# EAGLE design Pwm (EAGLE 7.4.0)
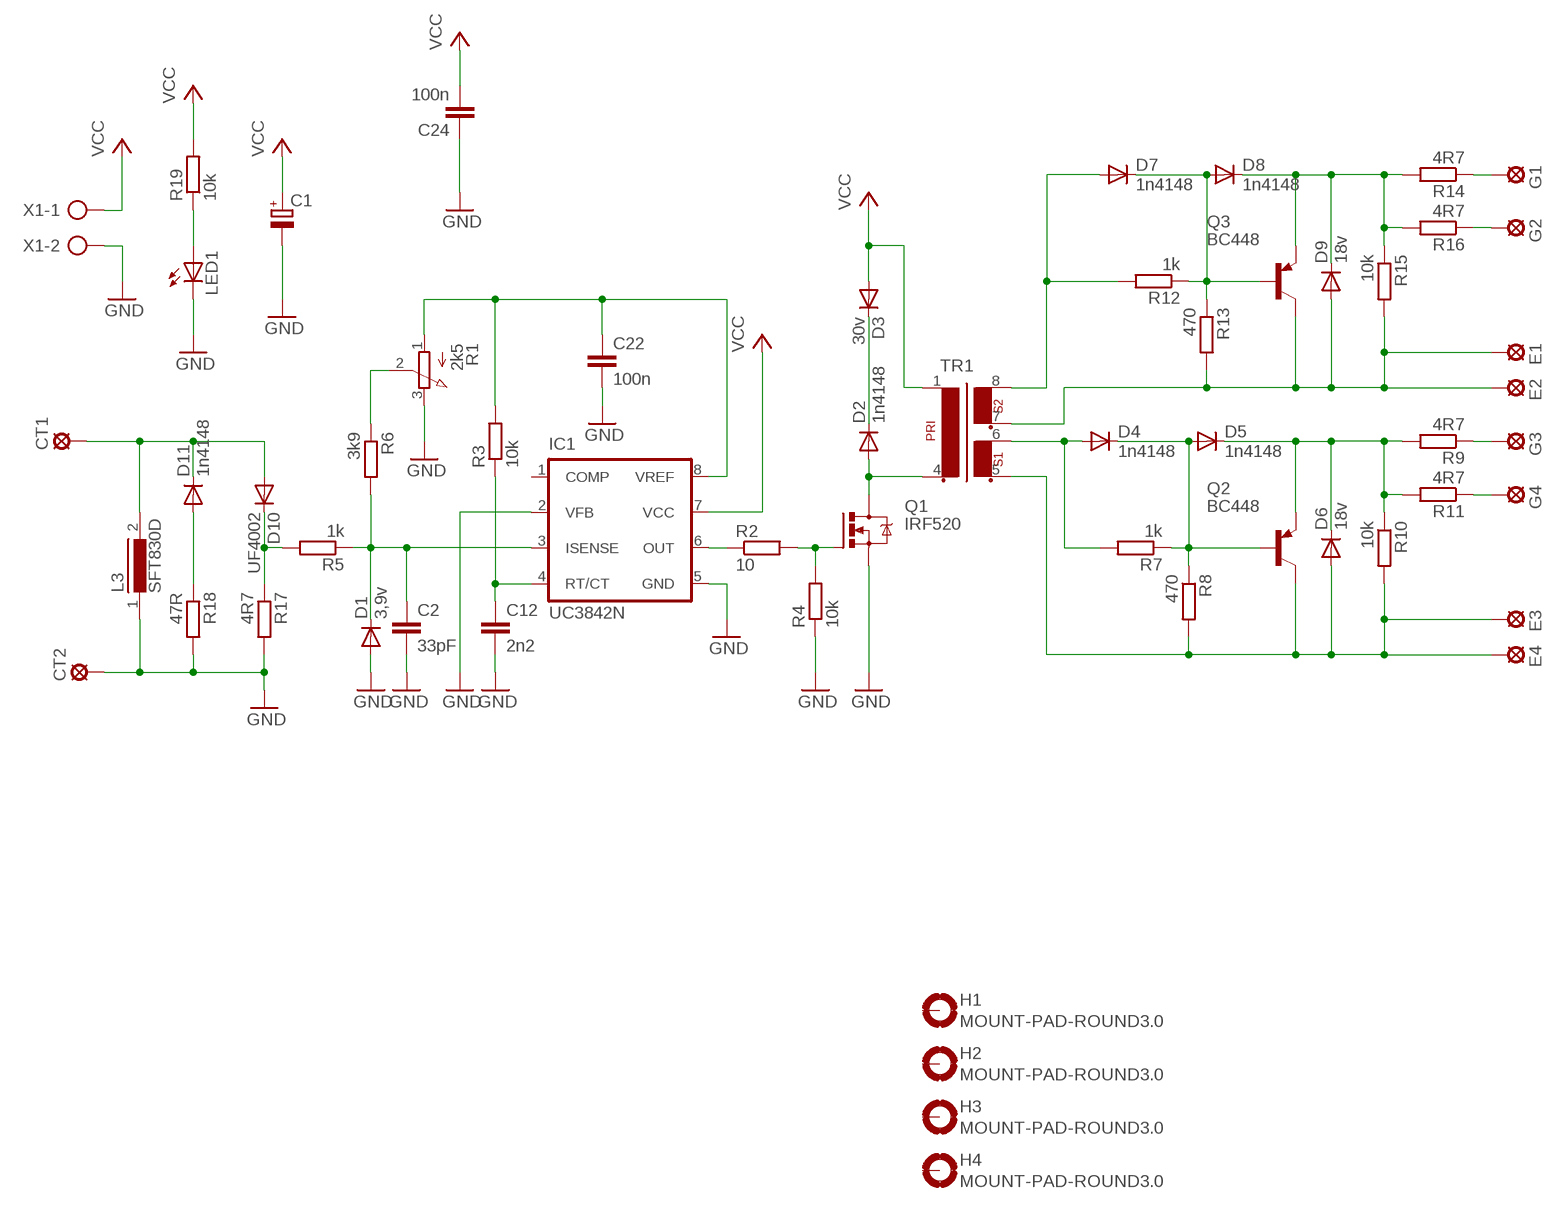
[diagram p0: schematic, sheet 1]

## Parts
C1  CPOL-EUE5-6  [E5-6]
C2  33pF  C-EU050-025X075  [C050-025X075]
C12  2n2  C-EU050-025X075  [C050-025X075]
C22  100n  C-EU050-025X075  [C050-025X075]
C24  100n  C-EU050-025X075  [C050-025X075]
CT1  SE14  [SE14]
CT2  SE14  [SE14]
D1  3,9v  1N4446  [DO35-10]
D2  1n4148  1N4446  [DO35-10]
D3  30v  1N4446  [DO35-10]
D4  1n4148  1N4446  [DO35-10]
D5  1n4148  1N4446  [DO35-10]
D6  18v  1N4446  [DO35-10]
D7  1n4148  1N4446  [DO35-10]
D8  1n4148  1N4446  [DO35-10]
D9  18v  1N4446  [DO35-10]
D10  UF4002  1N4446  [DO35-10]
D11  1n4148  1N4446  [DO35-10]
E1  SE14  [SE14]
E2  SE14  [SE14]
E3  SE14  [SE14]
E4  SE14  [SE14]
G1  SE14  [SE14]
G2  SE14  [SE14]
G3  SE14  [SE14]
G4  SE14  [SE14]
H1  MOUNT-PAD-ROUND3.0  [3,0-PAD]
H2  MOUNT-PAD-ROUND3.0  [3,0-PAD]
H3  MOUNT-PAD-ROUND3.0  [3,0-PAD]
H4  MOUNT-PAD-ROUND3.0  [3,0-PAD]
IC1  UC3842N  [DIL08]
L3  SFT830D  [SFT830D]
LED1  LED5MM  [LED5MM]
Q1  IRF520  [TO220BV]
Q2  BC448  [TO92-EBC]
Q3  BC448  [TO92-EBC]
R1  2k5  3RP/1610N  [3RP/1610N]
R2  10  R-EU_0207/10  [0207/10]
R3  10k  R-EU_0207/10  [0207/10]
R4  10k  R-EU_0207/10  [0207/10]
R5  1k  R-EU_0207/10  [0207/10]
R6  3k9  R-EU_0207/10  [0207/10]
R7  1k  R-EU_0207/10  [0207/10]
R8  470  R-EU_0207/10  [0207/10]
R9  4R7  R-EU_0207/10  [0207/10]
R10  10k  R-EU_0207/10  [0207/10]
R11  4R7  R-EU_0207/10  [0207/10]
R12  1k  R-EU_0207/10  [0207/10]
R13  470  R-EU_0207/10  [0207/10]
R14  4R7  R-EU_0207/10  [0207/10]
R15  10k  R-EU_0207/10  [0207/10]
R16  4R7  R-EU_0207/10  [0207/10]
R17  4R7  R-EU_0207/10  [0207/10]
R18  47R  R-EU_0207/10  [0207/10]
R19  10k  R-EU_0207/10  [0207/10]
TR1  EE20-2  [EE20-2]
X1  AK300/2  [AK300/2]

## Nets
GND: C1.- C2.2 C12.2 C22.2 C24.1 CT2.MP D1.A IC1.2(VFB) IC1.5(GND) L3.1 LED1.K(C) Q1.S R1.3(E) R4.1 R17.2 R18.2 X1.2
GND1: D6.A E3.MP E4.MP Q2.C R8.2 R10.2 TR1.5
GND2: D9.A E1.MP E2.MP Q3.C R13.2 R15.2 TR1.7
N$1: C22.1 IC1.8(VREF) R1.1(A) R3.2
N$2: C12.1 IC1.4(RT/CT) R3.1
N$3: IC1.6(OUT) R2.1
N$4: Q1.G R2.2 R4.2
N$5: C2.1 D1.C IC1.3(ISENSE) R5.1 R6.2
N$6: D2.A Q1.D TR1.4
N$7: R1.2(S) R6.1
N$8: D2.C D3.C
N$9: LED1.A R19.1
N$10: D5.C D6.C Q2.E R9.2 R10.1 R11.2
N$11: D4.C D5.A Q2.B R7.1 R8.1
N$12: D4.A R7.2 TR1.6
N$13: G3.MP R9.1
N$14: G4.MP R11.1
N$16: D8.C D9.C Q3.E R14.2 R15.1 R16.2
N$17: D7.C D8.A Q3.B R12.1 R13.1
N$18: D7.A R12.2 TR1.8
N$19: G1.MP R14.1
N$20: G2.MP R16.1
N$21: D11.A R18.1
N$22: D10.C R5.2 R17.1
N$23: CT1.MP D10.A D11.C L3.2
VCC: C1.+ C24.2 D3.A IC1.7(VCC) R19.2 TR1.1 X1.1
Unconnected: H1.B3,0(MOUNT) H2.B3,0(MOUNT) H3.B3,0(MOUNT) H4.B3,0(MOUNT) IC1.1(COMP)

## Library data of the parts
C1 = rcl:CPOL-EU: POLARIZED CAPACITOR, European symbol
C2 C12 C22 C24 = rcl:C-EU: CAPACITOR, European symbol
CT1 CT2 E1-E4 G1-G4 = solpad:SE14: SOLDER PAD E1553, drill 1,4mm, distributor Buerklin, 07F820
D1-D11 = diode:1N4446: DIODE high speed (Philips)
H1-H4 = holes:MOUNT-PAD-ROUND: MOUNTING PAD, round
IC1 = v-reg:UC384*: SMPS Controller Source: http://www.fairchildsemi.com/ds/UC/UC3843.pdf
L3 = inductors:SFT830D: INDUCTOR
LED1 = led:LED: LED OSRAM: - CHIPLED LG R971, LG N971, LY N971, LG Q971, LY Q971, LO R971, LY R971 LH N974, LH R974 LS Q976, LO Q976, LY Q976 LO Q996 - Hyper CHIPLED LW Q18S LB Q993, LB Q99A, LB R99A - SideLED LS A670, LO A670, LY A670, LG A670, LP A670 LB A673, LV A673, LT A673, LW A673 LH A674 LY A675 LS A676, LA A676, LO A676, LY A676, LW A676 LS A679, LY A679, LG A679 - Hyper Micro SIDELED® LS Y876, LA Y876, LO Y876, LY Y876 LT Y87S - SmartLED LW L88C, LW L88S LB L89C, LB L89S, LG L890 LS L89K, LO L89K, LY L89K LS L896, LA L896, LO L896, LY L896 - TOPLED LS T670, LO T670, LY T670, LG T670, LP T670 LSG T670, LSP T670, LSY T670, LOP T670, LYG T670 LG T671, LOG T671, LSG T671 LB T673, LV T673, LT T673, LW T673 LH T674 LS T676, LA T676, LO T676, LY T676, LB T676, LH T676, LSB T676, LW T676 LB T67C, LV T67C, LT T67C, LS T67K, LO T67K, LY T67K, LW E67C LS E67B, LA E67B, LO E67B, LY E67B, LB E67C, LV E67C, LT E67C LW T67C LS T679, LY T679, LG T679 LS T770, LO T770, LY T770, LG T770, LP T770 LB T773, LV T773, LT T773, LW T773 LH T774 LS E675, LA E675, LY E675, LS T675 LS T776, LA T776, LO T776, LY T776, LB T776 LHGB T686 LT T68C, LB T68C - Hyper Mini TOPLED® LB M676 - Mini TOPLED Santana® LG M470 LS M47K, LO M47K, LY M47K Source: http://www.osram.convergy.de LUXEON: - LUMILED® LXK2-PW12-R00, LXK2-PW12-S00, LXK2-PW14-U00, LXK2-PW14-V00 LXK2-PM12-R00, LXK2-PM12-S00, LXK2-PM14-U00 LXK2-PE12-Q00, LXK2-PE12-R00, LXK2-PE12-S00, LXK2-PE14-T00, LXK2-PE14-U00 LXK2-PB12-K00, LXK2-PB12-L00, LXK2-PB12-M00, LXK2-PB14-N00, LXK2-PB14-P00, LXK2-PB14-Q00 LXK2-PR12-L00, LXK2-PR12-M00, LXK2-PR14-Q00, LXK2-PR14-R00 LXK2-PD12-Q00, LXK2-PD12-R00, LXK2-PD12-S00 LXK2-PH12-R00, LXK2-PH12-S00 LXK2-PL12-P00, LXK2-PL12-Q00, LXK2-PL12-R00 Source: www.luxeon.com KINGBRIGHT: KA-3528ASYC Source: www.kingbright.com
Q1 = transistor-power:IRF520: HEXFET Power MOSFET
Q2 Q3 = transistor-pnp:BC448*: PNP Transistror
R1 = pot:3RP/1610N: 16mm Potentiometer one level Source: http://www.alphapotentiometers.net/html/16mm_pot_2.html
R2-R19 = rcl:R-EU_: RESISTOR, European symbol
TR1 = trafo:EE20-2: TRANSFORMER 1 primary winding, 2 secondary windings ERA
X1 = con-ptr500:AK300/2: CONNECTOR; OC_FARNELL: unknown; OC_NEWARK: unknown

## Board
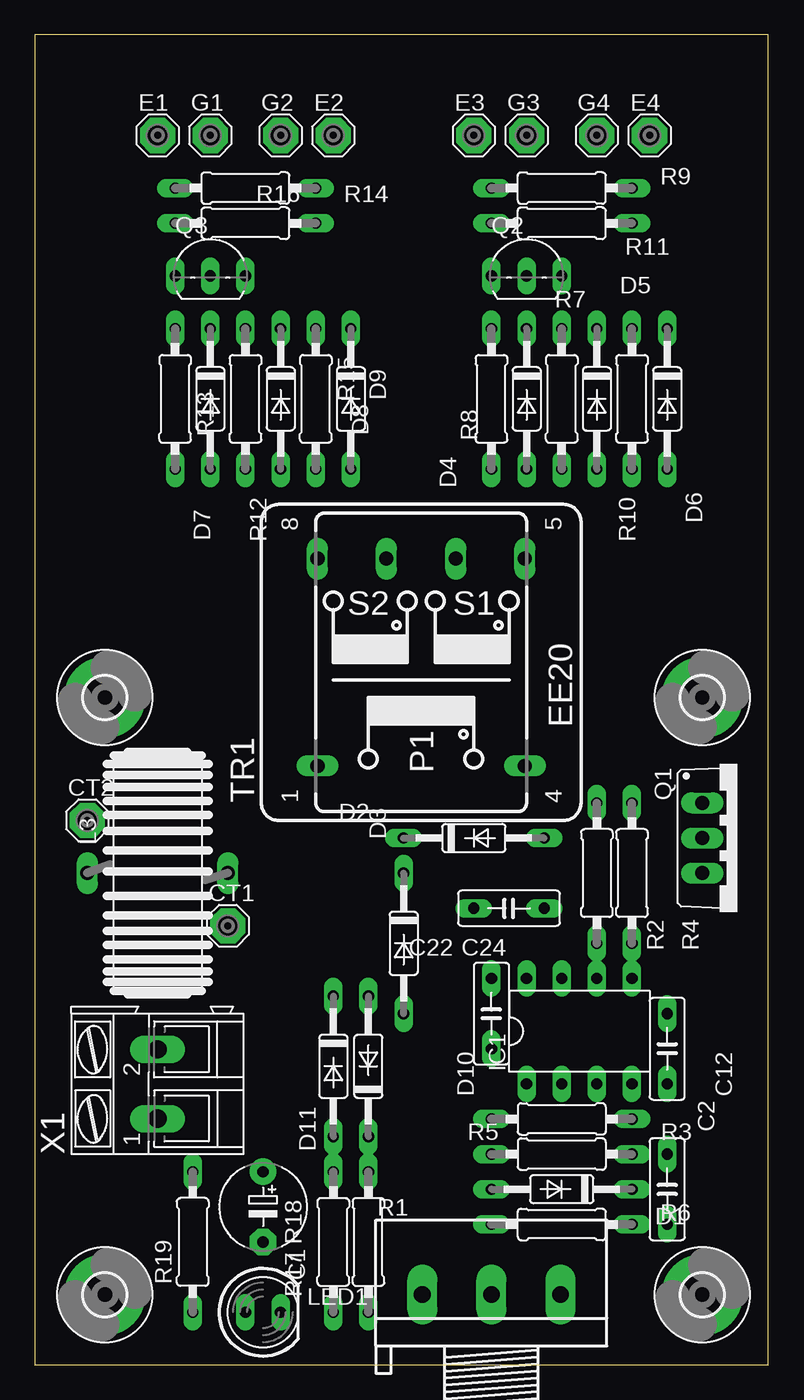
[diagram p1: board, top side]
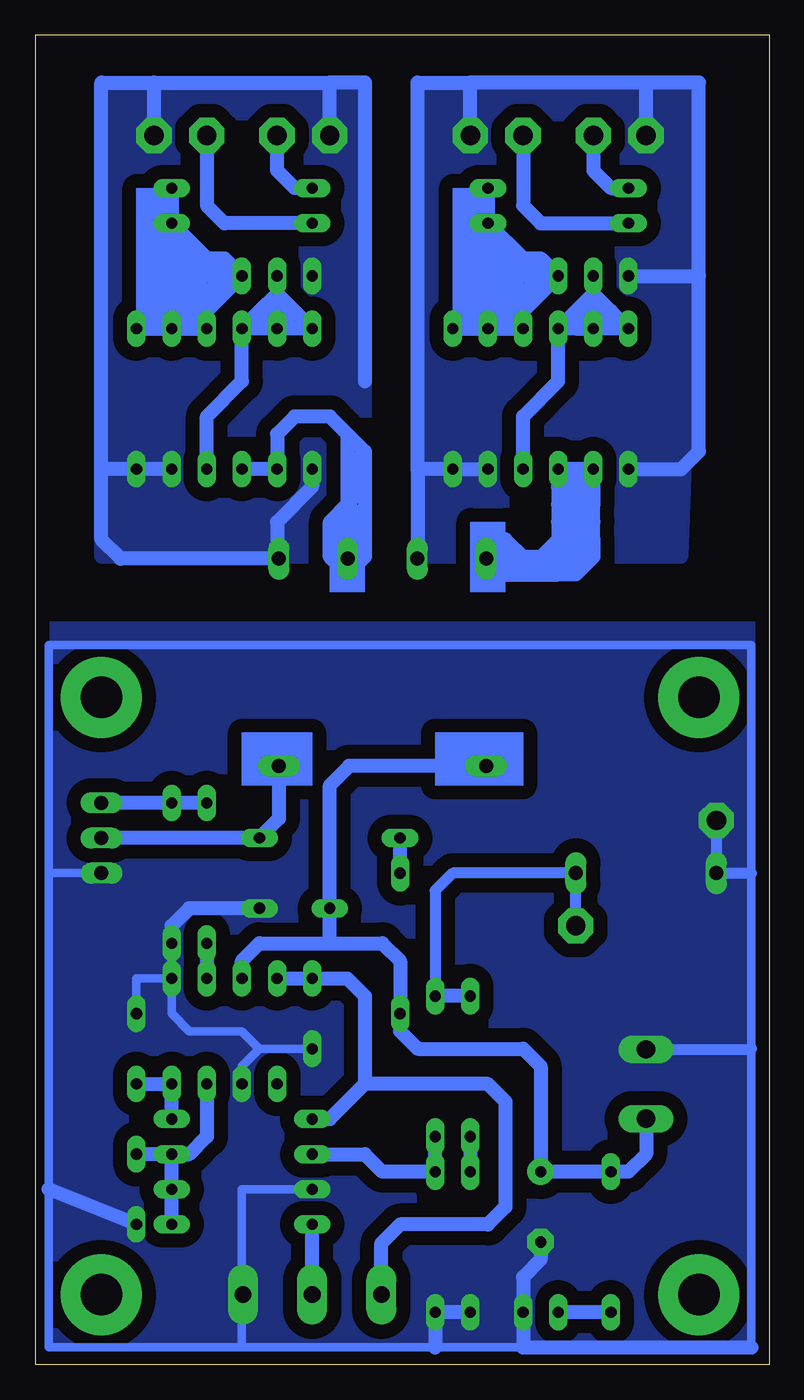
[diagram p2: board, bottom side, seen from below]

Size 53.01 x 96.19 mm. Coordinates in mm from the lower left corner, seen from the top.
Outline: 0,0 53.01,0 53.01,96.19 0,96.19 0,0
Copper layers (1*16): Top 0.035mm / dielectric 1.5mm / Bottom 0.035mm
Design rules "default": minimum track width 10mil, minimum drill 24mil, track to track 8mil, track to pad 8mil, pad to pad 8mil, via to via 8mil, smd to smd 8mil, copper to edge 40mil, drill to drill 8mil, minimum pad ring 10mil, minimum via ring 8mil, stop-mask expansion 4mil, vias tented up to drill 0mil, thermal gap 10mil

### Footprints (pad centres in the part's own frame; a part is rotated, then mirrored left to right if it is on the bottom)
E5-6 = drill 0.813 pad 1.905: + -2.54,0 | drill 0.813 pad 1.905 octagon: - 2.54,0
C050-025X075 = drill 0.813 long: 1 -2.54,0; 2 2.54,0
SE14 = drill 1.397 pad 2.54 octagon: MP 0,0
DO35-10 = drill 0.813 long: A 5.08,0; C -5.08,0
3,0-PAD = drill 3 pad 5.842: B3,0 0,0
DIL08 = drill 0.813 long: 1 -3.81,-3.81; 2 -1.27,-3.81; 3 1.27,-3.81; 4 3.81,-3.81; 5 3.81,3.81; 6 1.27,3.81; 7 -1.27,3.81; 8 -3.81,3.81
SFT830D = drill 1.016 long: 1 -5.08,0; 2 5.08,0
LED5MM = drill 0.813 long: A -1.27,0; K 1.27,0
TO220BV = drill 1.016 long: D 0,-2.54; G -2.54,-2.54; S 2.54,-2.54
TO92-EBC = drill 0.813 long: B 0,-1.27; C -2.54,-1.27; E 2.54,-1.27
3RP/1610N = drill 1.2 pad 2.184 long: 1 -5,0; 2 0,0; 3 5,0
0207/10 = drill 0.813 long: 1 -5.08,0; 2 5.08,0
EE20-2 = drill 1.016 long: 1 -7.493,7.493; 4 -7.493,-7.493; 5 7.493,-7.493; 6 7.493,-2.515; 7 7.493,2.515; 8 7.493,7.493
AK300/2 = drill 1.321 long: 1 -2.515,0; 2 2.489,0

### Placement (x,y rotation side)
C1  16.51,11.43 270 top
C2  45.72,12.7 270 top
C12  45.72,22.86 90 top
C22  33.02,25.4 270 top
C24  34.29,33.02 180 top
CT1  13.97,31.75 0 top
CT2  3.81,39.37 0 top
D1  38.1,12.7 180 top
D2  31.75,38.1 0 top
D3  26.67,30.48 270 top
D4  35.56,69.85 270 top
D5  40.64,69.85 270 top
D6  45.72,69.85 270 top
D7  12.7,69.85 270 top
D8  17.78,69.85 270 top
D9  22.86,69.85 270 top
D10  24.13,21.59 90 top
D11  21.59,21.59 270 top
E1  8.89,88.9 0 top
E2  21.59,88.9 0 top
E3  31.75,88.9 0 top
E4  44.45,88.9 0 top
G1  12.7,88.9 0 top
G2  17.78,88.9 0 top
G3  35.56,88.9 0 top
G4  40.64,88.9 0 top
H1  5.08,5.08 0 top
H2  48.26,5.08 0 top
H3  5.08,48.26 0 top
H4  48.26,48.26 0 top
IC1  39.37,24.13 0 top
L3  8.89,35.56 0 top
LED1  16.51,3.81 0 top
Q1  50.8,38.1 270 top
Q2  35.56,80.01 0 top
Q3  12.7,80.01 0 top
R1  33.02,5.08 0 top
R2  40.64,35.56 90 top
R3  38.1,17.78 180 top
R4  43.18,35.56 90 top
R5  38.1,15.24 180 top
R6  38.1,10.16 0 top
R7  38.1,69.85 270 top
R8  33.02,69.85 270 top
R9  38.1,85.09 0 top
R10  43.18,69.85 270 top
R11  38.1,82.55 0 top
R12  15.24,69.85 270 top
R13  10.16,69.85 270 top
R14  15.24,85.09 0 top
R15  20.32,69.85 270 top
R16  15.24,82.55 0 top
R17  24.13,8.89 270 top
R18  21.59,8.89 270 top
R19  11.43,8.89 90 top
TR1  27.94,50.8 90 top
X1  8.89,20.32 90 top

### Tracks (layer width: path | path; a pad name or v marks a point on that pad's centre or on a via)
GND
  Bottom 0.61: 38.1,1.27 52.07,1.27 52.07,12.7 52.07,35.56 | 38.1,1.27 24.13,1.27 17.78,1.27 | 1.27,1.27 1.27,22.86 1.27,35.56 1.27,52.07 52.07,52.07 52.07,35.56 | 38.1,1.27 38.1,5.08 R1.3 38.1,5.16 38.1,12.7 D1.A | C22.2 36.83,22.86 | 36.83,22.86 38.1,21.59 IC1.2 | IC1.5 45.72,27.94 C12.2 | IC1.5 43.18,25.4 41.91,24.13 38.1,24.13 36.83,22.86 | IC1.5 R4.1 | Q1.S 52.07,35.56
  Bottom 0.813: 1.27,35.56 L3.1 CT2.MP | X1.2 1.32,22.81 1.27,22.86
  Bottom 1.016: 24.13,1.27 R17.2 R18.2 | C24.1 41.91,33.02 43.18,31.75 R4.1 | C1.- 16.51,7.62 17.78,6.35 LED1.K 17.78,1.27 1.27,1.27 | C2.2 52.07,12.7
  pour Bottom (isolate 1.016, no thermals): -1.27,53.34 54.61,53.34 54.61,-1.27 0,-1.27
GND1
  Bottom 1.016: E3.MP 31.75,92.71 | 29.21,71.12 29.21,92.71 31.75,92.71 | R10.2 48.26,64.77 | 48.26,64.77 48.26,92.71 44.45,92.71 | 44.45,92.71 31.75,92.71 | E4.MP 44.45,92.71 | 48.26,64.77 48.26,59.69 46.86,58.29 TR1.5 35.56,58.42 35.56,60.96 33.02,63.5 R8.2
  pour Bottom (isolate 1.016, no thermals): 29.21,92.71 29.21,58.42 48.26,58.42 48.26,92.71
GND2
  Bottom 1.016: E2.MP 21.59,92.71 | 25.4,64.77 D9.A R15.2 | 25.4,64.77 25.4,92.71 21.59,92.71 | E1.MP 8.89,92.71 | 8.89,92.71 21.59,92.71 | 5.08,78.74 5.08,92.71 8.89,92.71 | 25.4,64.77 25.4,58.32 TR1.7 | Q3.C 5.08,78.74 | R13.2 6.35,64.77 5.08,66.04 5.08,78.74
  pour Bottom (isolate 1.016, no thermals): 5.08,92.71 6.35,58.42 25.4,58.42 25.4,92.71
N$1
  Bottom 1.016: R1.1 28.02,8.81 26.67,10.16 20.32,10.16 19.05,11.43 19.05,19.05 20.32,20.32 29.21,20.32 | IC1.8 C22.1 30.48,27.94 29.21,26.67 29.21,20.32 | R3.2 31.75,17.78 29.21,20.32
N$2
  Bottom 1.016: C12.1 IC1.4 R3.1
N$3
  Bottom 1.016: R2.1 IC1.6
N$4
  Bottom 1.016: R2.2 R4.2 Q1.G
N$5
  Bottom 1.016: IC1.3 40.64,16.51 41.91,15.24 R5.1 | R6.2 D1.C R5.1 | R5.1 C2.1
N$6
  Bottom 1.016: TR1.4 35.43,39.5 D2.A Q1.D
N$7
  Bottom 1.016: R1.2 R6.1
N$8
  Bottom 1.016: D3.C D2.C
N$9
  Bottom 1.016: R19.1 LED1.A
N$10
  Bottom 1.016: R10.1 D5.C | D6.C R10.1 | R11.2 43.18,81.28 | 43.18,80.01 43.18,78.74 | 43.18,78.74 R10.1 | Q2.E 39.37,78.74 | 39.37,78.74 40.64,78.74 | 40.64,78.74 41.91,78.74 | 41.91,78.74 43.18,78.74 | R9.2 R11.2 | R11.2 40.64,80.01 | 40.64,80.01 39.37,80.01 Q2.E | Q2.E 40.64,76.2 40.64,77.47 39.37,78.74 | 39.37,78.74 40.64,80.01 | 40.64,80.01 41.91,80.01 | 41.91,80.01 43.18,81.28 | 43.18,81.28 43.18,80.01 | 43.18,80.01 41.91,78.74 | 41.91,78.74 41.91,80.01 | 41.91,80.01 40.64,78.74
N$11
  Bottom 1.016: 35.56,77.47 35.56,76.2 | 35.56,76.2 D4.C | D5.A 40.64,68.58 38.1,71.12 R7.1 | Q2.B 35.56,77.47 | 35.56,77.47 34.29,76.2 | 34.29,76.2 R8.1 D4.C | D4.C 36.83,74.93 | 36.83,74.93 R7.1 | R7.1 36.83,76.2 | 36.83,76.2 35.56,77.47 | 34.29,76.2 D4.C | D4.C 36.83,76.2 | 36.83,76.2 36.83,74.93 | 35.56,76.2 36.83,76.2 | 35.56,76.2 34.29,76.2
N$12
  Bottom 1.016: R7.2 D4.A 35.56,67.31 34.29,68.58 31.75,68.58 30.45,67.28 | TR1.6 30.45,67.28 | 30.45,67.28 29.21,66.04 | 29.21,66.04 29.21,64.77 | 29.21,64.77 29.21,63.5 | 29.21,63.5 29.21,60.96 | 29.21,60.96 29.21,58.42 30.48,57.15 31.75,58.42 31.75,60.96 | 31.75,60.96 30.48,62.23 | 30.48,62.23 29.21,60.96 | 29.21,60.96 31.75,60.96 | 30.48,62.23 29.21,63.5 | 29.21,63.5 30.48,63.5 29.21,64.77 | 29.21,64.77 30.48,64.77 29.21,66.04
N$13
  Bottom 1.016: R9.1 34.29,85.09 35.56,86.36 G3.MP
N$14
  Bottom 1.016: G4.MP 40.64,83.82 39.37,82.55 R11.1
N$16
  Bottom 1.016: R15.1 D8.C | D9.C R15.1 | R16.2 20.32,81.28 | 20.32,80.01 20.32,78.74 | 20.32,78.74 R15.1 | Q3.E 16.51,78.74 | 16.51,78.74 17.78,78.74 | 19.05,78.74 20.32,78.74 | R14.2 R16.2 | R16.2 17.78,80.01 | 17.78,80.01 16.51,80.01 Q3.E | Q3.E 16.51,77.47 | 17.78,77.47 16.51,77.47 | 16.51,77.47 17.78,76.2 17.78,77.47 | 17.78,77.47 16.51,78.74 | 16.51,78.74 17.78,80.01 | 17.78,80.01 19.05,80.01 | 19.05,80.01 20.32,81.28 | 20.32,81.28 20.32,80.01 | 20.32,80.01 19.05,78.74 | 19.05,78.74 17.78,80.01 | 17.78,80.01 17.78,78.74 | 17.78,78.74 19.05,78.74 | 19.05,78.74 19.05,80.01
N$17
  Bottom 1.016: 12.7,77.47 D7.C | D8.A 17.78,68.58 15.24,71.12 R12.1 | Q3.B 12.7,77.47 | 12.7,77.47 11.43,76.2 | 11.43,76.2 R13.1 11.43,74.93 | 11.43,74.93 D7.C | 13.97,74.93 R12.1 | R12.1 13.97,76.2 | 12.7,77.47 13.97,76.2 | 13.97,76.2 D7.C | D7.C 11.43,76.2 | 11.43,76.2 13.97,76.2 | 13.97,76.2 13.97,74.93 | 13.97,74.93 D7.C | 11.43,74.93 11.43,76.2
N$18
  Bottom 1.016: TR1.8 16.64,58.29 | 16.64,58.29 16.51,58.42 | 16.51,58.42 15.24,59.69 | D7.A 12.7,62.23 | 12.7,59.69 12.7,58.42 13.97,57.15 15.24,57.15 | 19.05,57.15 20.32,57.15 20.32,59.69 19.05,59.69 | 19.05,59.69 17.78,58.42 | 17.78,58.42 19.05,58.42 | 19.05,58.42 19.05,59.69 | 19.05,58.42 19.05,57.15 | 17.78,57.15 16.51,57.15 | 16.51,57.15 15.24,57.15 | 15.24,57.15 13.97,58.42 | 13.97,58.42 15.24,58.42 | 15.24,58.42 16.51,58.42 | 16.51,58.42 17.78,58.42 | 17.78,58.42 19.05,57.15 | 19.05,57.15 17.78,57.15 | 17.78,57.15 16.64,58.29 | 16.51,58.42 16.51,57.15 | 16.51,57.15 15.24,58.42 | 15.24,58.42 13.97,59.69 | 13.97,59.69 13.97,62.23 | 13.97,62.23 13.97,63.5 | 13.97,63.5 13.97,64.77 | 13.97,64.77 R12.2 15.24,63.5 | 15.24,63.5 15.24,62.23 | 15.24,60.96 15.24,59.69 | 13.97,58.42 15.24,59.69 | 15.24,59.69 13.97,59.69 | 13.97,59.69 12.7,59.69 | 12.7,59.69 12.7,60.96 | 12.7,60.96 13.97,60.96 15.24,59.69 | 13.97,58.42 12.7,59.69 | 12.7,59.69 15.24,62.23 | 15.24,62.23 13.97,62.23 | 13.97,62.23 12.7,60.96 | 12.7,60.96 12.7,62.23 | 12.7,62.23 13.97,63.5 | D7.A 13.97,64.77 | 13.97,64.77 15.24,63.5 | 15.24,63.5 13.97,63.5 | 13.97,63.5 D7.A | D7.A 12.7,63.5 13.97,62.23 | 13.97,62.23 15.24,63.5 | 15.24,62.23 15.24,60.96 | 15.24,60.96 13.97,59.69
N$19
  Bottom 1.016: G1.MP 12.7,86.36 11.43,85.09 R14.1
N$20
  Bottom 1.016: G2.MP 17.78,83.82 16.51,82.55 R16.1
N$21
  Bottom 1.016: D11.A R18.1
N$22
  Bottom 1.016: D10.C R17.1 27.94,13.97 29.21,15.24 R5.2
N$23
  Bottom 0.813: D10.A 24.13,34.29 22.86,35.56 L3.2 CT1.MP
  Bottom 1.016: D11.C D10.A
VCC
  Bottom 1.016: IC1.7 38.1,29.21 36.83,30.48 31.75,30.48 | 31.75,30.48 C24.2 31.75,41.91 30.35,43.31 TR1.1 | 31.75,30.48 27.94,30.48 26.67,29.21 D3.A 26.67,24.13 25.4,22.86 17.78,22.86 16.51,21.59 C1.+ R19.2 10.16,13.97 8.89,15.24 X1.1
(copper drawn outside any net)
  shapes: Bottom area x8